# Altium schematic sheet AVRController.SchDoc
size A4
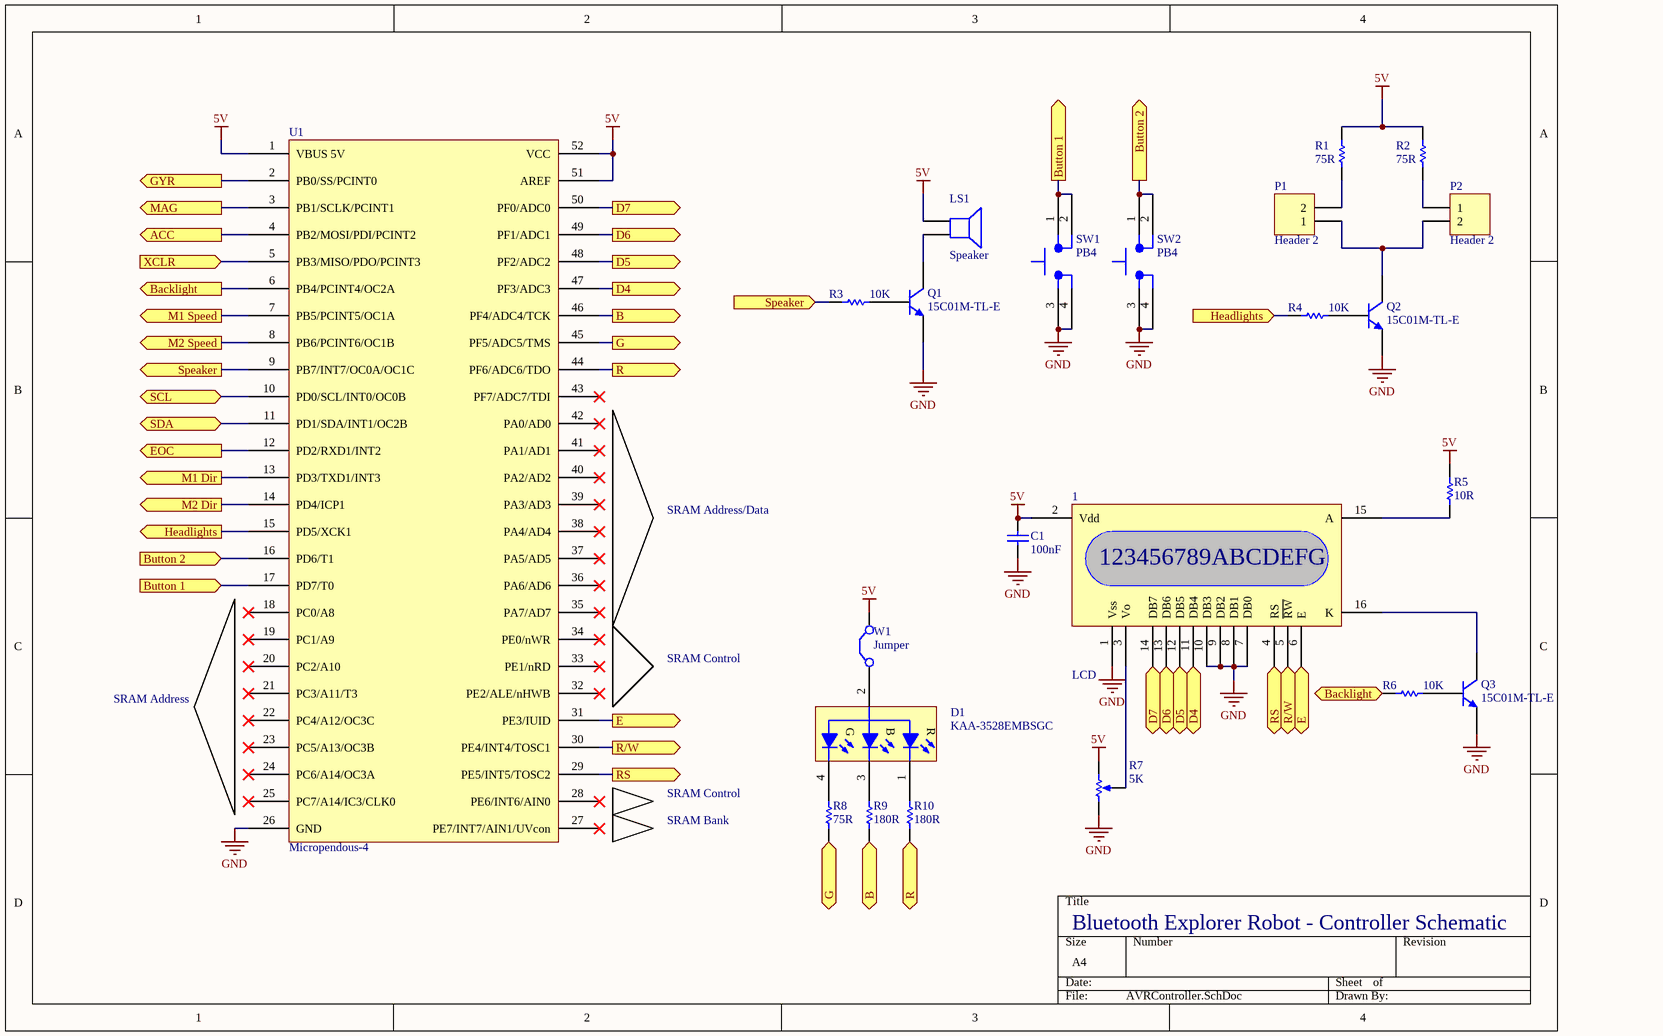
[diagram p0: AVRController.SchDoc]

## Parts
1  LCD  [LCD_PADS]
C1  value 100nF  [2012[0805]]
D1  KAA-3528EMBSGC  [KAA-3528EMBSGC]
LS1  Speaker  [PIN2]
P1  Header 2  [HDR1X2]
P2  Header 2  [HDR1X2]
Q1  15C01M-TL-E  [SOT323]
Q2  15C01M-TL-E  [SOT323]
Q3  15C01M-TL-E  [SOT323]
R1  value 75R  [2012[0805]]  (hidden comment: Res Semi)
R2  value 75R  [2012[0805]]  (hidden comment: Res Semi)
R3  value 10K  [2012[0805]]  (hidden comment: Res Semi)
R4  value 10K  [2012[0805]]  (hidden comment: Res Semi)
R5  value 10R  [2012[0805]]
R6  value 10K  [2012[0805]]  (hidden comment: Res Semi)
R7  value 5K  [POT1]
R8  value 75R  [2012[0805]]  (hidden comment: Res Semi)
R9  value 180R  [2012[0805]]  (hidden comment: Res Semi)
R10  value 180R  [2012[0805]]  (hidden comment: Res Semi)
SW1  PB4  [PB2x2]
SW2  PB4  [PB2x2]
U1  Micropendous-4  [Micropendous-4]
W1  Jumper  [RAD-0.2]

## Ports
ACC (out), B (in), B (out), Backlight (in), Backlight (out), Button 1 (in), Button 1 (out), Button 2 (in), Button 2 (out), D4 (in), D4 (out), D5 (in), D5 (out), D6 (in), D6 (out), D7 (in), D7 (out), E (in), E (out), EOC (out), G (in), G (out), GYR (out), Headlights (in), Headlights (out), M1 Dir (out), M1 Speed (out), M2 Dir (out), M2 Speed (out), MAG (out), R (in), R (out), R/W (in), R/W (out), RS (in), RS (out), SCL (bidir), SDA (bidir), Speaker (in), Speaker (out), XCLR (in)

## Nets
5V: 1.2(Vdd) C1.1 LS1.1 R1.2 R2.2 R5.2 R7.2(BOT) U1.1(VBUS_5V) U1.51(AREF) U1.52(VCC) W1.2(C2)
GND: 1.1(Vss) 1.7(DB0) 1.8(DB1) 1.9(DB2) 1.10(DB3) C1.2 Q1.1(E) Q2.1(E) Q3.1(E) R7.1(TOP) SW1.3 SW1.4 SW2.3 SW2.4 U1.26(GND)
ACC: U1.4(PB2/MOSI/PDI/PCINT2) ; port ACC
B: R9.1 U1.46(PF4/ADC4/TCK) ; port B
Backlight: R6.1 U1.6(PB4/PCINT4/OC2A) ; port Backlight
Button 1: SW1.1 SW1.2 U1.17(PD7/T0) ; port Button 1
Button 2: SW2.1 SW2.2 U1.16(PD6/T1) ; port Button 2
D4: 1.11(DB4) U1.47(PF3/ADC3) ; port D4
D5: 1.12(DB5) U1.48(PF2/ADC2) ; port D5
D6: 1.13(DB6) U1.49(PF1/ADC1) ; port D6
D7: 1.14(DB7) U1.50(PF0/ADC0) ; port D7
E: 1.6(E) U1.31(PE3/IUID) ; port E
EOC: U1.12(PD2/RXD1/INT2) ; port EOC
G: R8.1 U1.45(PF5/ADC5/TMS) ; port G
GYR: U1.2(PB0/SS/PCINT0) ; port GYR
Headlights: R4.1 U1.15(PD5/XCK1) ; port Headlights
M1 Dir: U1.13(PD3/TXD1/INT3) ; port M1 Dir
M1 Speed: U1.7(PB5/PCINT5/OC1A) ; port M1 Speed
M2 Dir: U1.14(PD4/ICP1) ; port M2 Dir
M2 Speed: U1.8(PB6/PCINT6/OC1B) ; port M2 Speed
MAG: U1.3(PB1/SCLK/PCINT1) ; port MAG
R: R10.1 U1.44(PF6/ADC6/TDO) ; port R
R/W: 1.5(~{RW}) U1.30(PE4/INT4/TOSC1) ; port R/W
RS: 1.4(RS) U1.29(PE5/INT5/TOSC2) ; port RS
SCL: U1.10(PD0/SCL/INT0/OC0B) ; port SCL
SDA: U1.11(PD1/SDA/INT1/OC2B) ; port SDA
Speaker: R3.1 U1.9(PB7/INT7/OC0A/OC1C) ; port Speaker
XCLR: U1.5(PB3/MISO/PDO/PCINT3) ; port XCLR
Net1_3: 1.3(Vo) R7.3(TAP)
Net1_15: 1.15(A) R5.1
Net1_16: 1.16(K) Q3.3(C)
NetD1_1: D1.1(R) R10.2
NetD1_2: D1.2(A2) W1.1(C1)
NetD1_3: D1.3(B) R9.2
NetD1_4: D1.4(G) R8.2
NetLS1_2: LS1.2 Q1.3(C)
NetP1_1: P1.1 P2.2 Q2.3(C)
NetP1_2: P1.2 R1.1
NetP2_1: P2.1 R2.1
NetQ1_2: Q1.2(B) R3.2
NetQ2_2: Q2.2(B) R4.2
NetQ3_2: Q3.2(B) R6.2

Not connected (* = marked no-connect by the designer): U1 18(PC0/A8)* 19(PC1/A9)* 20(PC2/A10)* 21(PC3/A11/T3)* 22(PC4/A12/OC3C)* 23(PC5/A13/OC3B)* 24(PC6/A14/OC3A)* 25(PC7/A14/IC3/CLK0)* 27(PE7/INT7/AIN1/UVcon)* 28(PE6/INT6/AIN0)* 32(PE2/ALE/nHWB)* 33(PE1/nRD)* 34(PE0/nWR)* 35(PA7/AD7)* 36(PA6/AD6)* 37(PA5/AD5)* 38(PA4/AD4)* 39(PA3/AD3)* 40(PA2/AD2)* 41(PA1/AD1)* 42(PA0/AD0)* 43(PF7/ADC7/TDI)*

## Notes on the sheet
- SRAM Address/Data
- SRAM Address
- SRAM Control
- SRAM Bank
- Bluetooth Explorer Robot - Controller Schematic
- (in symbol LCD) 123456789ABCDEFG

## Library data of the parts
C1 = Cap Semi: Capacitor (Semiconductor SIM Model); Published: 8-Jun-2000; LatestRevisionDate: 17-Jul-2002; LatestRevisionNote: Re-released for DXP Platform.; PackageReference: C1206; Publisher: Altium Limited
D1 = S1204RGBSDJC: Ultra-Bright RGB Tri-color LED Lamp, 4-Lead 1204-size SMD; Published: 14-Mar-2008; DatasheetVersion: Aug-2006; PackageVersion: Aug-2006; PackageReference: LED1204; Publisher: Altium Limited; PackageDescription: SM Tri-color LED Lamp, 4-Leads 1204-size; ComponentLink1Description: Manufacturer Link; ComponentLink1URL: http://www.sansentech.com/; ComponentLink2Description: Datasheet; ComponentLink2URL: http://www.sansentech.com/LED/S1204RGBSDJC.pdf
LS1 = Speaker: Loudspeaker; Published: 24-Mar-1999; LatestRevisionDate: 17-Jul-2002; LatestRevisionNote: Re-released for DXP Platform.; PackageReference: PIN2; Publisher: Altium Limited
P1 P2 = Header 2: Header, 2-Pin; LatestRevisionDate: 17-Jul-2002; LatestRevisionNote: Re-released for DXP Platform.; Publisher: Altium Limited
Q1-Q3 = 2N3904: NPN General Purpose Amplifier; Published: 8-Jun-2000; LatestRevisionDate: 15-Jan-2003; LatestRevisionNote: PCB Footprint 'BCY-W3/D4.7' replaced; DatasheetVersion: 1997; PackageVersion: Sep-1998; PackageReference: TO-92A; Publisher: Altium Limited; Code_JEDEC: TO-92A; ComponentLink1Description: Manufacturer Link; ComponentLink1URL: http://www.fairchildsemi.com/; ComponentLink2Description: Datasheet; ComponentLink2URL: http://www.fairchildsemi.com/ds/2N%2F2N3904.pdf
R1-R4 R6 R8-R10 = Res Semi: Semiconductor Resistor; Published: 8-Jun-2000; LatestRevisionDate: 17-Jul-2002; LatestRevisionNote: Re-released for DXP Platform.; PackageReference: AXIAL-0.5; Publisher: Altium Limited
R5 = Res1: Resistor; Published: 8-Jun-2000; LatestRevisionDate: 17-Jul-2002; LatestRevisionNote: Re-released for DXP Platform.; PackageReference: AXIAL-0.3; Publisher: Altium Limited
R7 = RPot: Potentiometer; Sim Note: Enter the Resistance value and the set point into parameter fields.; Set Position: 0.5; Published: 8-Jun-2000; LatestRevisionDate: 17-Jul-2002; LatestRevisionNote: Re-released for DXP Platform.; PackageReference: VR5; Publisher: Altium Limited
W1 = Jumper: Jumper Wire; Published: 24-Mar-1999; LatestRevisionDate: 17-Jul-2002; LatestRevisionNote: Re-released for DXP Platform.; PackageReference: RAD-0.2; Publisher: Altium Limited